# Altium schematic sheet FaultDet.SchDoc
size A; SheetNumber: 14; SheetTotal: 15
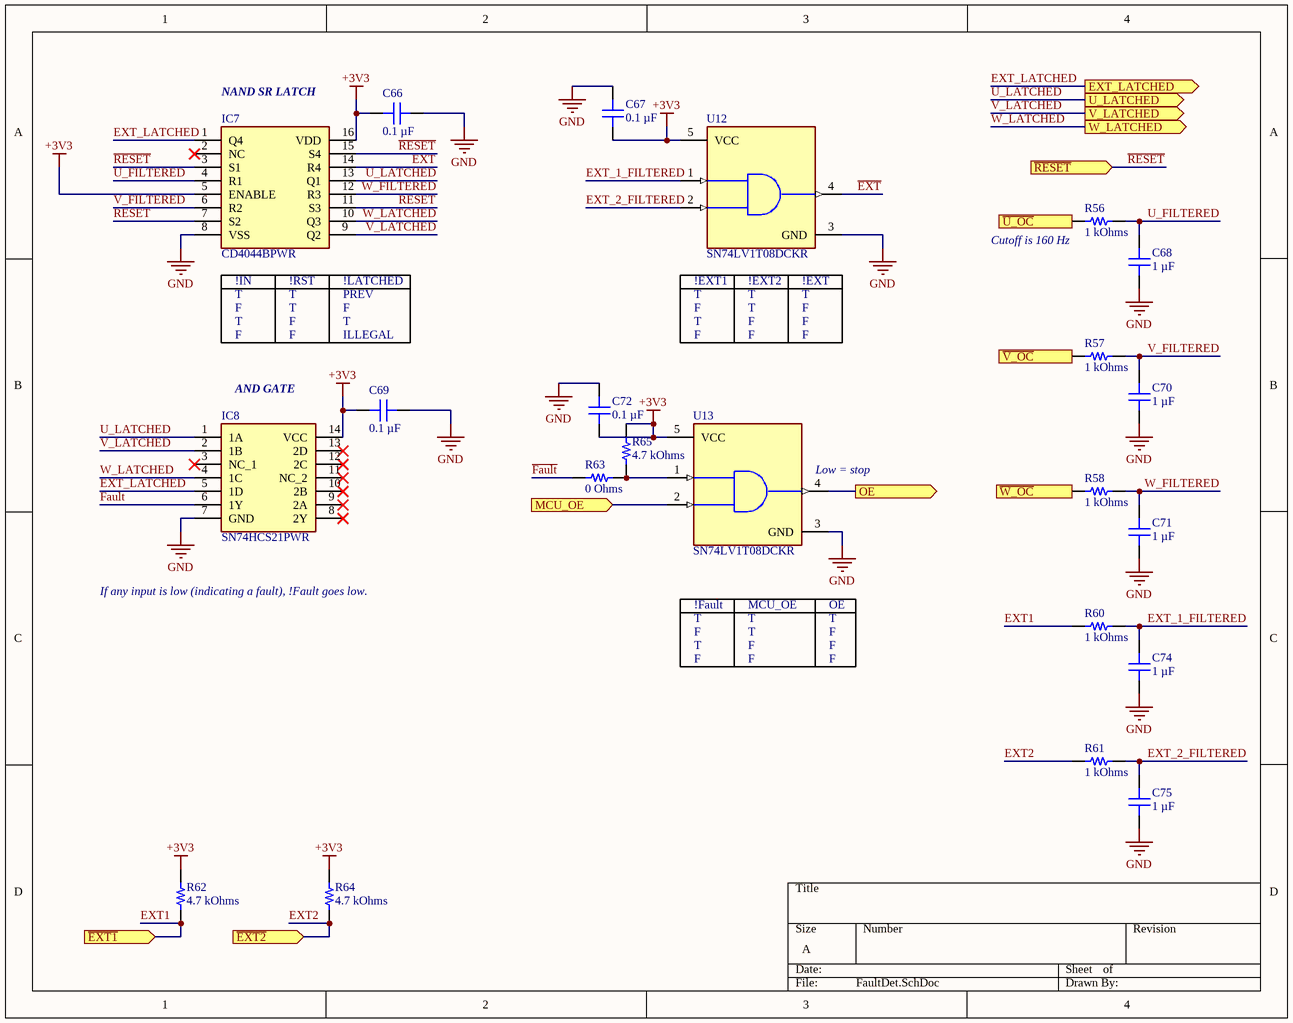
[diagram p0: FaultDet.SchDoc]

## Parts
C66  0.1 µF  [CAP 0402_1005]
C67  0.1 µF  [CAP 0402_1005]
C68  1 µF  [MURATA GRM155 0402_1005]
C69  0.1 µF  [CAP 0402_1005]
C70  1 µF  [MURATA GRM155 0402_1005]
C71  1 µF  [MURATA GRM155 0402_1005]
C72  0.1 µF  [CAP 0402_1005]
C74  1 µF  [MURATA GRM155 0402_1005]
C75  1 µF  [MURATA GRM155 0402_1005]
IC7  CD4044BPWR  [SOP65P640X120-16N]
IC8  SN74HCS21PWR  [SOP65P640X120-14N]
R56  1 kOhms  [YAGEO RES 0402_1005]
R57  1 kOhms  [YAGEO RES 0402_1005]
R58  1 kOhms  [YAGEO RES 0402_1005]
R60  1 kOhms  [YAGEO RES 0402_1005]
R61  1 kOhms  [YAGEO RES 0402_1005]
R62  4.7 kOhms  [YAGEO RES 0402_1005]
R63  0 Ohms  [RES 0402_1005]
R64  4.7 kOhms  [YAGEO RES 0402_1005]
R65  4.7 kOhms  [YAGEO RES 0402_1005]
U12  SN74LV1T08DCKR  [FP-DCK0005A-IPC_C]
U13  SN74LV1T08DCKR  [FP-DCK0005A-IPC_C]

## Ports
EXT_LATCHED (out), MCU_OE (in), OE (out), U_LATCHED (out), V_LATCHED (out), W_LATCHED (out), ~{EXT1} (in), ~{EXT2} (in), ~{RESET} (in), ~{U_OC} (in), ~{V_OC} (in), ~{W_OC} (in)

## Nets
+3V3: C66.2 C67.1 C69.2 C72.1 IC7.5(ENABLE) IC7.16(VDD) IC8.14(VCC) R62.2 R64.2 R65.2 U12.5(VCC) U13.5(VCC)
GND: C66.1 C67.2 C68.1 C69.1 C70.1 C71.1 C72.2 C74.1 C75.1 IC7.8(VSS) IC8.7(GND) U12.3(GND) U13.3(GND)
~{EXT}: IC7.14(R4) U12.4(Y)
EXT1: R60.1 R62.1 ; port ~{EXT1}
EXT2: R61.1 R64.1 ; port ~{EXT2}
EXT_1_FILTERED: C74.2 R60.2 U12.1(A)
EXT_2_FILTERED: C75.2 R61.2 U12.2(B)
EXT_LATCHED: IC7.1(Q4) IC8.5(1D) ; port EXT_LATCHED
~{Fault}: IC8.6(1Y) R63.1
MCU_OE: U13.2(B) ; port MCU_OE
OE: U13.4(Y) ; port OE
~{RESET}: IC7.3(S1) IC7.7(S2) IC7.11(S3) IC7.15(S4) ; port ~{RESET}
~{U_OC}: R56.1 ; port ~{U_OC}
U_FILTERED: C68.2 IC7.4(R1) R56.2
U_LATCHED: IC7.13(Q1) IC8.1(1A) ; port U_LATCHED
~{V_OC}: R57.1 ; port ~{V_OC}
V_FILTERED: C70.2 IC7.6(R2) R57.2
V_LATCHED: IC7.9(Q2) IC8.2(1B) ; port V_LATCHED
~{W_OC}: R58.1 ; port ~{W_OC}
W_FILTERED: C71.2 IC7.12(R3) R58.2
W_LATCHED: IC7.10(Q3) IC8.4(1C) ; port W_LATCHED
NetR63_2: R63.2 R65.1 U13.1(A)

Not connected (* = marked no-connect by the designer): IC7 2(NC)*; IC8 3(NC_1)* 8(2Y)* 9(2A)* 10(2B)* 11(NC_2)* 12(2C)* 13(2D)*

## Notes on the sheet
- (near IC7) NAND SR LATCH
- (near IC7) !IN
- T
- (near IC7) !RST
- (near IC7) !LATCHED
- PREV
- (near U12) !EXT1
- (near U12) !EXT2
- (near U12) !EXT
- (near R56) Cutoff is 160 Hz
- F
- ILLEGAL
- (near IC8) AND GATE
- (near U13) Low = stop
- If any input is low (indicating a fault), !Fault goes low.
- !Fault
- MCU_OE
- OE

## Library data of the parts
C66 C67 C69 C72 = C0402C104K4RECAUTO: CAP CER 0402 0.1UF 16V X7R 10%; manufacturer: KEMET; Part Number: C0402C104K4RECAUTO; Capacitance: 0.1 µF; Applications: Automotive, ESD Protection; componentlink1description: Datasheet; componentlink1url: https://api.kemet.com/component-edge/download/datasheet/C0402C104K4RECAUTO.pdf; componentlink2description: DigiKey Link; componentlink2url: https://www.digikey.com/en/products/detail/kemet/C0402C104K4RECAUTO/8563695; Device Package: 0402 (1005 Metric); lastupdated: 2/9/2024 8:04:38 PM; Lifecycle Status: Active; Minimum Order: 1; Mounting Type: Surface Mount, MLCC; Operating Temperature: -55°C ~ 125°C; Package / Case: 0402 (1005 Metric); packaging: TapeAndReel; partid: 1731; Part Status: Active; price: 0.01; Ratings: AEC-Q200; series: ESD SMD Auto X7R; Size / Dimension: 0.039" L x 0.020" W (1.00mm x 0.50mm); Supplier 1: DigiKey; Supplier Part Number 1: 399-17167-1-ND; Temperature Coefficient: X7R; Thickness (Max): 0.022" (0.55mm); Tolerance: ±10%; value: 0.1 µF; Voltage - Rated: 16V
C68 C70 C71 C74 C75 = GRM155C71A105KE11D: CAP CER 1UF 10V X7S 0402; manufacturer: Murata Electronics; Tolerance: ±10%; Part Number: GRM155C71A105KE11D; Capacitance: 1 µF; Applications: General Purpose; componentlink1description: Datasheet; componentlink1url: https://search.murata.co.jp/Ceramy/image/img/A01X/G101/ENG/GRM155C71A105KE11-01.pdf; componentlink2description: DigiKey Link; componentlink2url: https://www.digikey.com/en/products/detail/murata-electronics/GRM155C71A105KE11D/6606086; Device Package: 0402 (1005 Metric); lastupdated: 7/23/2025 10:42:36 AM; Lifecycle Status: Active; Minimum Order: 1; Mounting Type: Surface Mount, MLCC; Operating Temperature: -55°C ~ 125°C; Package / Case: 0402 (1005 Metric); packaging: TapeAndReel; partid: 1749; Part Status: Active; price: 0.01; series: GRM; Size / Dimension: 0.039" L x 0.020" W (1.00mm x 0.50mm); Supplier 1: DigiKey; Supplier Part Number 1: 490-14457-1-ND; Temperature Coefficient: X7S; Thickness (Max): 0.024" (0.60mm); value: 1 µF; Voltage - Rated: 10V
IC7 = CD4044BPWR: Integrated Circuit; Manufacturer_Name: Texas Instruments; Datasheet Link: http://www.ti.com/lit/gpn/cd4044b; Height: 1.2mm; Manufacturer_Part_Number: CD4044BPWR; Mouser Part Number: 595-CD4044BPWR; Mouser Price/Stock: https://www.mouser.co.uk/ProductDetail/Texas-Instruments/CD4044BPWR?qs=LSR%252BNeaw%2FwA0JC88gEuhWQ%3D%3D; Arrow Part Number: CD4044BPWR; Arrow Price/Stock: https://www.arrow.com/en/products/cd4044bpwr/texas-instruments?utm_currency=USD&region=nac
IC8 = SN74HCS21PWR: Integrated Circuit; Manufacturer_Name: Texas Instruments; Datasheet Link: https://www.ti.com/lit/gpn/SN74HCS21; Height: 1.2mm; Manufacturer_Part_Number: SN74HCS21PWR; Mouser Part Number: 595-SN74HCS21PWR; Mouser Price/Stock: https://www.mouser.co.uk/ProductDetail/Texas-Instruments/SN74HCS21PWR?qs=GedFDFLaBXETYHCH97WONA%3D%3D; Arrow Part Number: SN74HCS21PWR; Arrow Price/Stock: https://www.arrow.com/en/products/sn74hcs21pwr/texas-instruments?region=nac
R56-R58 R60 R61 = AT0402BRD071KL: RES SMD 1K OHM 0.1% 1/16W 0402; Manufacturer: Yageo; Power (Watts): 0.063W, 1/16W; Temperature Coefficient: ±25ppm/°C; Part Number: AT0402BRD071KL; Value: 1 kOhms; ComponentLink1Description: Datasheet; ComponentLink1URL: http://www.yageo.com/documents/recent/PYu-AT_51_RoHS_L_5.pdf; ComponentLink2Description: DigiKey Link; ComponentLink2URL: https://www.digikey.com/en/products/detail/yageo/AT0402BRD071KL/5138607; Composition: Thin Film; Device Package: 0402 (1005 Metric); Features: Anti-Sulfur, Automotive AEC-Q200, Moisture Resistant; Height - Seated (Max): 0.014" (0.35mm); LastUpdated: 8/31/2025 3:04:18 PM; Lifecycle Status: Active; Minimum Order: 1; Number of Terminations: 2; Operating Temperature: -55°C ~ 155°C; Package / Case: 0402 (1005 Metric); Packaging: TapeAndReel; PartId: 2462; Part Status: Active; Price: 0.09; Ratings: AEC-Q200; Resistance: 1 kOhms; Series: AT; Size / Dimension: 0.039" L x 0.020" W (1.00mm x 0.50mm); Supplier 1: DigiKey; Supplier Part Number 1: YAG2088CT-ND; Supplier Device Package: 0402; Tolerance: ±0.1%
R62 R64 R65 = RT0402FRE074K7L: RES SMD 4.7K OHM 1% 1/16W 0402; Manufacturer: Yageo; Power (Watts): 0.063W, 1/16W; Temperature Coefficient: ±50ppm/°C; Part Number: RT0402FRE074K7L; Value: 4.7 kOhms; ComponentLink1Description: Datasheet; ComponentLink1URL: https://www.yageo.com/upload/media/product/productsearch/datasheet/rchip/PYu-RT_1-to-0.01_RoHS_L_11.pdf; ComponentLink2Description: DigiKey Link; ComponentLink2URL: https://www.digikey.com/en/products/detail/yageo/RT0402FRE074K7L/1072052; Composition: Thin Film; Device Package: 0402 (1005 Metric); Height - Seated (Max): 0.014" (0.35mm); LastUpdated: 8/31/2025 3:04:17 PM; Lifecycle Status: Active; Minimum Order: 1; Number of Terminations: 2; Operating Temperature: -55°C ~ 155°C; Package / Case: 0402 (1005 Metric); Packaging: TapeAndReel; PartId: 3198; Part Status: Active; Price: 0.01; Resistance: 4.7 kOhms; Series: RT; Size / Dimension: 0.039" L x 0.020" W (1.00mm x 0.50mm); Supplier 1: DigiKey; Supplier Part Number 1: YAG3347CT-ND; Supplier Device Package: 0402; Tolerance: ±1%
R63 = 5112: 0402 JUMPER ON TAPE AND REEL; Part Number: 5112; Manufacturer: Keystone Electronics; Power (Watts): 0.5W, 1/2W; Value: 0 Ohms; ComponentLink1Description: Datasheet; ComponentLink1URL: http://www.keystoneelectronics.net/ENG._DEPT/WEB_ORACLE/PDF/PDF%20CAT%20NO%20DRAWINGS/5000-5999/5112.PDF; ComponentLink2Description: DigiKey Link; ComponentLink2URL: https://www.digikey.com/en/products/detail/keystone-electronics/5112/9921836; Composition: Metal Element; Device Package: 0402 (1005 Metric); Height - Seated (Max): 0.020" (0.50mm); LastUpdated: 2/9/2024 8:29:48 PM; Lifecycle Status: Active; Minimum Order: 1; Number of Terminations: 2; Package / Case: 0402 (1005 Metric); Packaging: TapeAndReel; PartId: 12597; Part Status: Active; Price: 0.16; Resistance: 0 Ohms; Series: -; Size / Dimension: 0.039" L x 0.020" W (1.00mm x 0.50mm); Supplier 1: DigiKey; Supplier Part Number 1: 36-5112-1-ND; Supplier Device Package: 0402; Tolerance: Jumper
U12 U13 = CMP-0859-00360-4: IC GATE AND 1CH 2-INP SC70-5; Propagation Delay: 7ns; Number of Bits: 1; Number of Inputs: 2; Low Level Output Current: 8mA; Logic Function: AND GATE; Output Current: 25mA; Max Supply Voltage: 5.5V; Quiescent Current: 1uA; Min Supply Voltage: 1.8V; High Level Output Current: -8mA; Number of Gates: 1; Radiation Hardening: No; Min Operating Temperature: -40°C; Max Operating Temperature: 125°C; Package Quantity: 3000; Number of Circuits: 1; Contact Plating: Gold; RoHS Compliant: Yes; Lead Free: Lead Free; Number of Input Lines: 2; Number of Pins: 5; Weight: 0.000705oz; Packaging: Tape and Reel; Mount: Surface Mount